# Altium schematic sheet ADC GPIO Expander.SchDoc
size A4; SheetNumber: 2; SheetTotal: 8
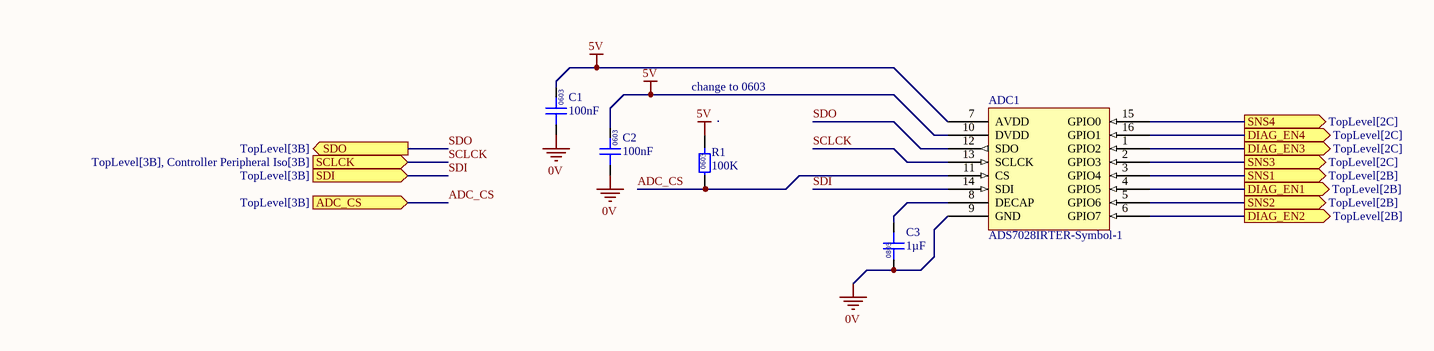
[diagram p0: ADC GPIO Expander.SchDoc]

## Parts
ADC1  ADS7028IRTER-Symbol-1  [WFQN-16]
C1  100nF  [0603]
C2  100nF  [0603]
C3  1µF  [0805]
R1  100K  [0603]

## Ports
ADC_CS (in, see TopLevel[3B]), DIAG_EN1 (out, see TopLevel[2B]), DIAG_EN2 (out, see TopLevel[2B]), DIAG_EN3 (out, see TopLevel[2C]), DIAG_EN4 (out, see TopLevel[2C]), SCLCK (in, see TopLevel[3B], Controller Peripheral Iso[3B]), SDI (in, see TopLevel[3B]), SDO (out, see TopLevel[3B]), SNS1 (out, see TopLevel[2B]), SNS2 (out, see TopLevel[2B]), SNS3 (out, see TopLevel[2C]), SNS4 (out, see TopLevel[2C])

## Nets
0V: ADC1.9(GND) C1.1 C2.1 C3.1
5V: ADC1.7(AVDD) ADC1.10(DVDD) C1.2 C2.2 R1.2
ADC_CS: ADC1.11(CS) R1.1 ; port ADC_CS
DIAG_EN1: ADC1.4(GPIO5) ; port DIAG_EN1
DIAG_EN2: ADC1.6(GPIO7) ; port DIAG_EN2
DIAG_EN3: ADC1.1(GPIO2) ; port DIAG_EN3
DIAG_EN4: ADC1.16(GPIO1) ; port DIAG_EN4
SCLCK: ADC1.13(SCLCK) ; port SCLCK
SDI: ADC1.14(SDI) ; port SDI
SDO: ADC1.12(SDO) ; port SDO
SNS1: ADC1.3(GPIO4) ; port SNS1
SNS2: ADC1.5(GPIO6) ; port SNS2
SNS3: ADC1.2(GPIO3) ; port SNS3
SNS4: ADC1.15(GPIO0) ; port SNS4
NetADC1_8: ADC1.8(DECAP) C3.2

## Notes on the sheet
- change to 0603
- (in symbol GCM21BR71H105KA03L) 0805
- (in symbol GCM188L81H104KA57D) 0603
- (in symbol RC0603FR-07100KL) 0603

## Library data of the parts
ADC1 = ADS7028IRTER: IC ADC 12BIT SAR 16WQFN; Manufacturer: Texas Instruments; Complex IC: 1; Part Number: ADS7028IRTER; Digikey Part Number: ADS7028IRTER; Digikey Link: https://www.digikey.com.au/en/products/detail/texas-instruments/ADS7028IRTER/12696020?s=N4IgTCBcDaIIIBEDKB2ADGAHASQEoBUBRXEAXQF8g
C1 C2 = GCM188L81H104KA57D: Manufacturer: muRata; Rated Voltage: 50V; Tolerance: ±10%; Material: MLCC; Temperature Rating: X8L; Part Number: GCM188L81H104KA57D; Value: 100nF; Digikey Part Number: 490-6049-1-ND
C3 = GCM21BR71H105KA03L: Manufacturer: muRata; Rated Voltage: 50V; Tolerance: ±10%; Material: MLCC; Temperature Rating: X7R; Part Number: GCM21BR71H105KA03L; Value: 1µF; Digikey Part Number: 490-10675-1-ND
R1 = RC0603FR-07100KL: Manufacturer: YAGEO; Tolerance: 0.01; Rated Power: 0.1W; Part Number: RC0603FR-07100KL; Value: 100K; Material: FR-07